# EasyEDA schematic SCH_DIY PowerBank_2023-05-28.json
TITLE: Sheet_1; REV: 1.0; Date: 2023-05-28; Sheet: 1/1; Drawn By: azlan777; Company: Your Company
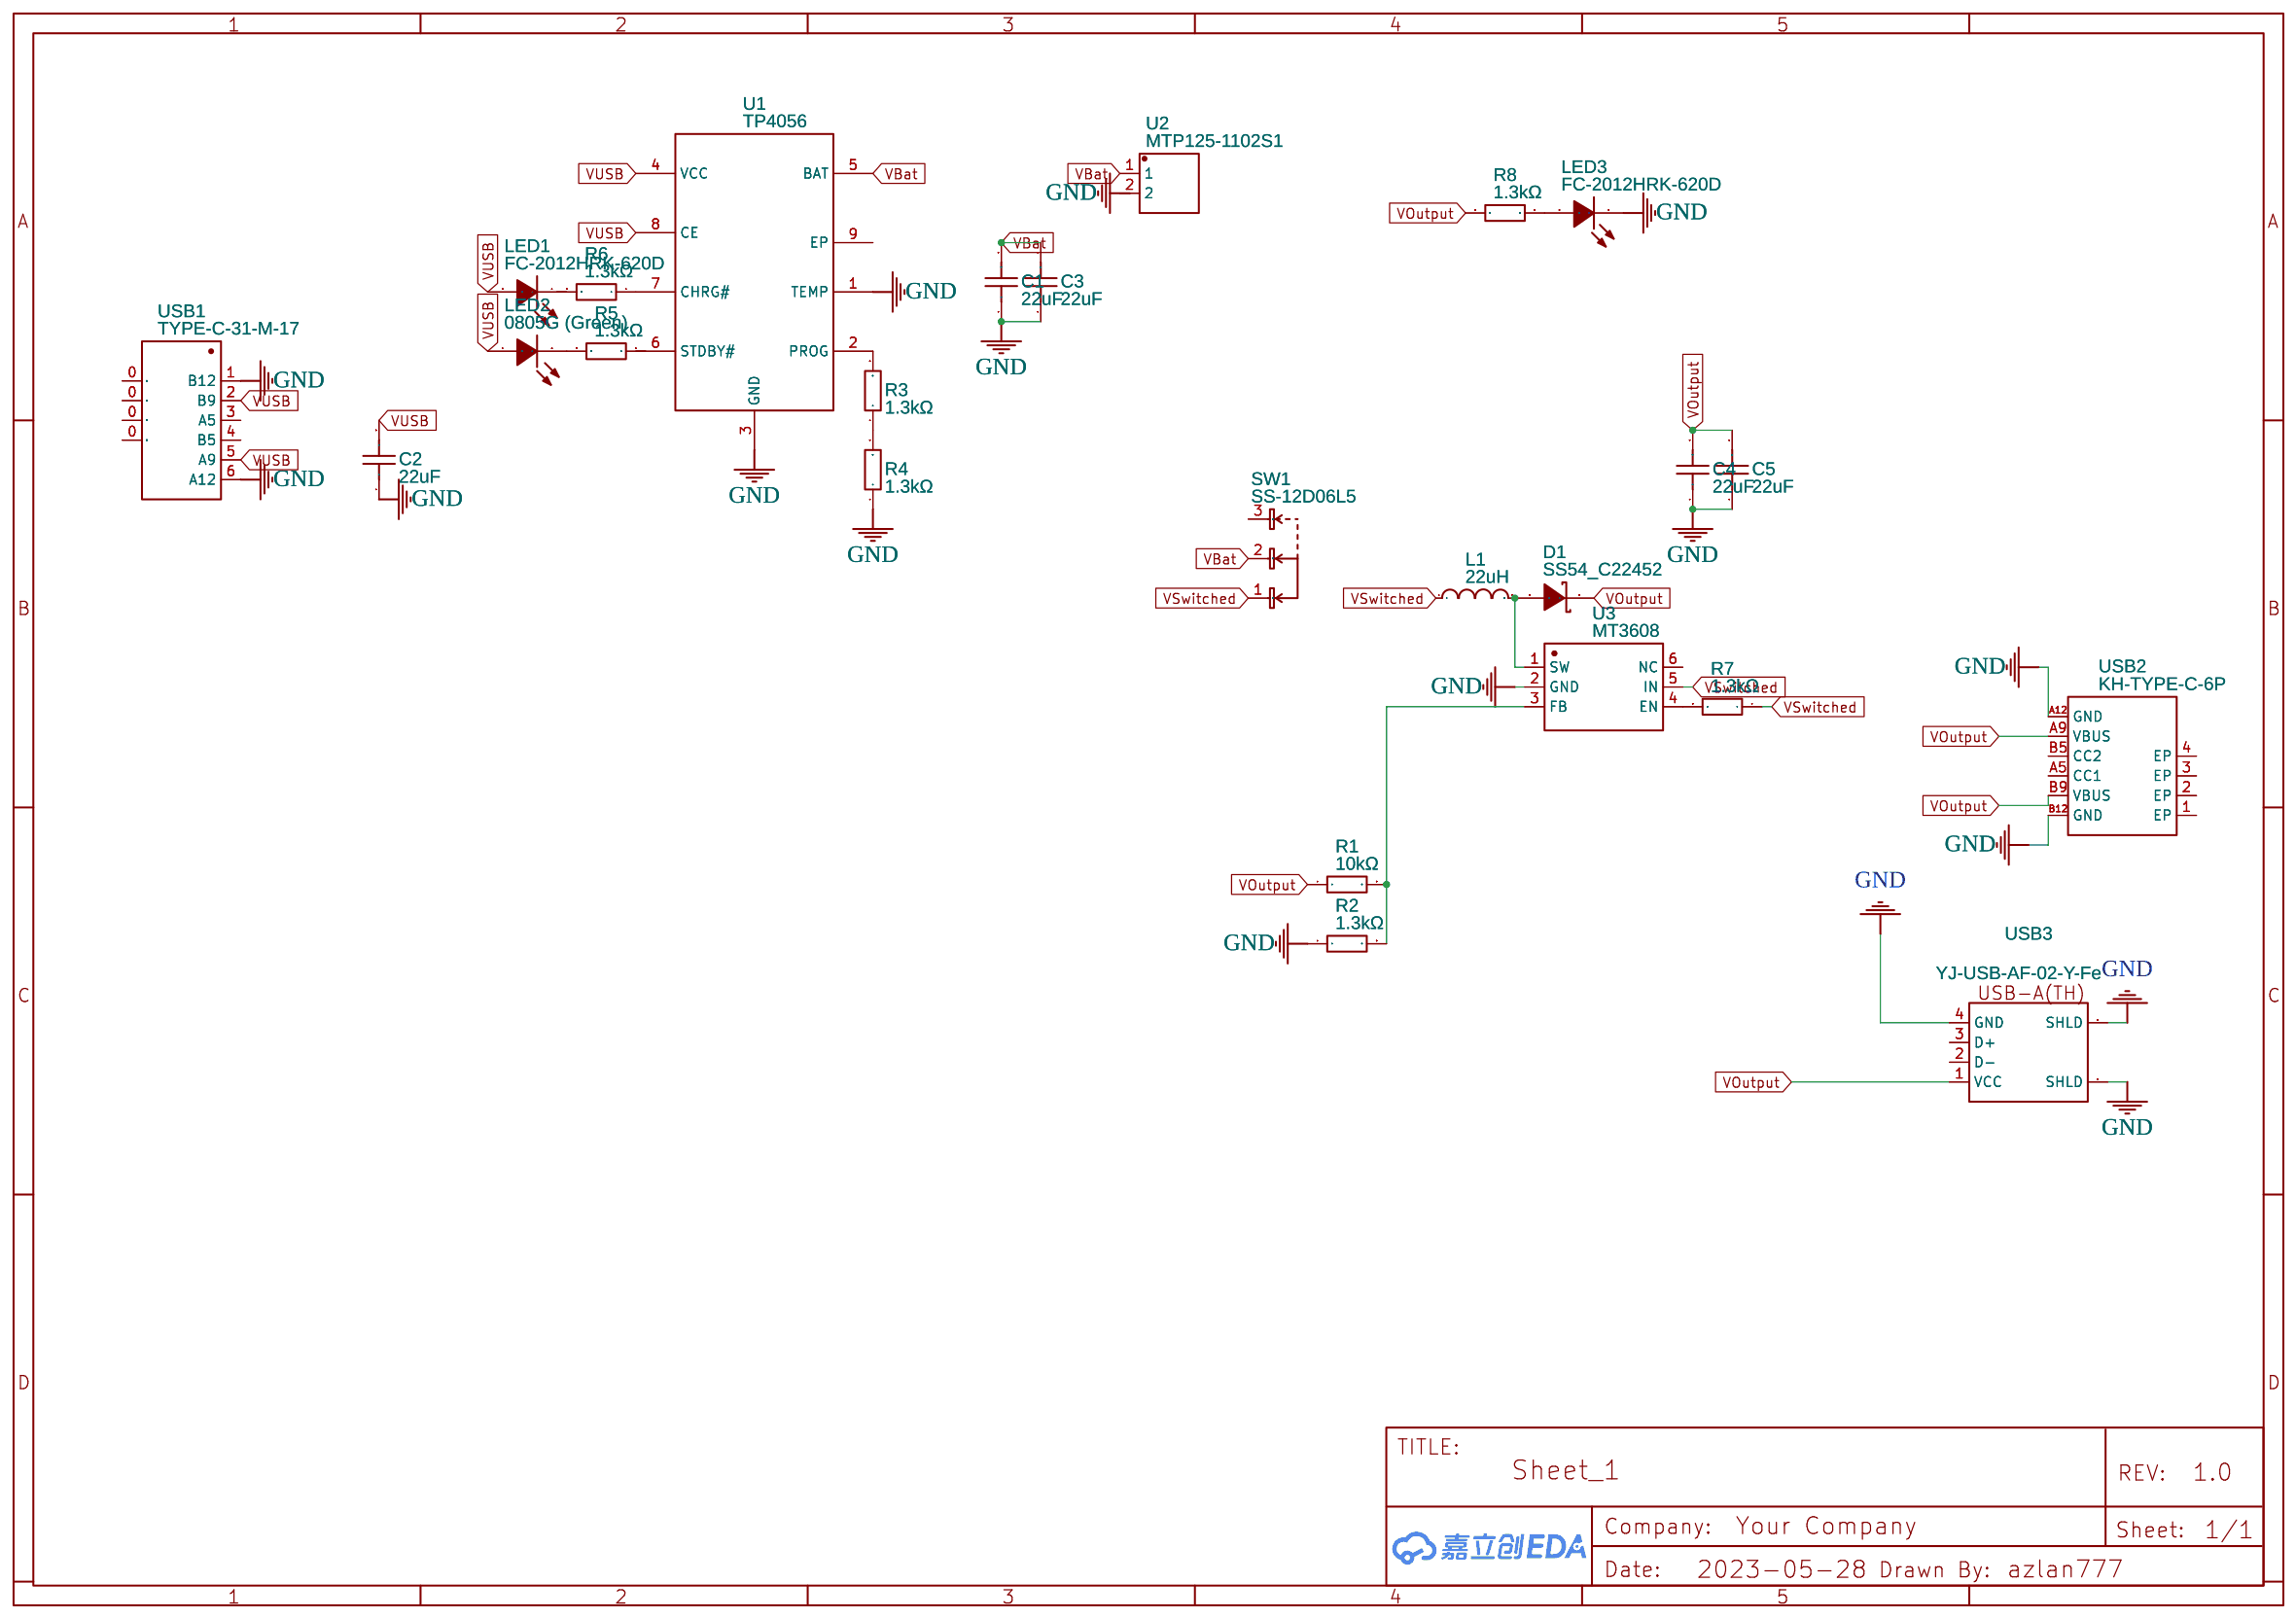
[diagram p0: schematic sheet]

## Parts
C1  22uF  [C0805]
C2  22uF  [C0805]
C3  22uF  [C0805]
C4  22uF  [C0805]
C5  22uF  [C0805]
D1  SS54_C22452  [SMA_L4.4-W2.8-LS5.4-R-RD]
L1  22uH  [IND-SMD_L7.8-W7.0_MAPM0630F]
LED1  FC-2012HRK-620D  [LED0805-RD_RED]
LED2  0805G (Green)  [LED0805-R-RD]
LED3  FC-2012HRK-620D  [LED0805-RD_RED]
R1  10kΩ  [R0603]
R2  1.3kΩ  [RES-TH_BD2.2-L6.5-P10.50-D0.6]
R3  1.3kΩ  [RES-TH_BD2.2-L6.5-P10.50-D0.6]
R4  1.3kΩ  [RES-TH_BD2.2-L6.5-P10.50-D0.6]
R5  1.3kΩ  [RES-TH_BD2.2-L6.5-P10.50-D0.6]
R6  1.3kΩ  [RES-TH_BD2.2-L6.5-P10.50-D0.6]
R7  1.3kΩ  [RES-TH_BD2.2-L6.5-P10.50-D0.6]
R8  1.3kΩ  [RES-TH_BD2.2-L6.5-P10.50-D0.6]
SW1  SS-12D06L5  [SW-TH_3P-P4.70_L11.1-W12.7]
U1  TP4056  [ESOP-8_L4.9-W3.9-P1.27-LS6.0-BL-EP]
U2  MTP125-1102S1  [HDR-TH_2P-P2.54-V-M-1]
U3  MT3608  [SOT-23-6_L2.9-W1.6-P0.95-LS2.8-BL]
USB1  TYPE-C-31-M-17  [USB-C-SMD_10P-P1.00-L6.8-W8.9]
USB2  KH-TYPE-C-6P  [TYPE-C-SMD_TYPE-C-31-M-16]
USB3  YJ-USB-AF-02-Y-Fe  [USB-A-TH_USB-A-F-90]

## Library data of the parts
C1-C5 = CL21A226MAQNNNE: Supplier: LCSC; Manufacturer: SAMSUNG(三星); Supplier Part: C45783; JLCPCB Part Class: Basic Part
D1 = SS54_C22452: Supplier: LCSC; Manufacturer Part: SS54; Manufacturer: MDD; Supplier Part: C22452; JLCPCB Part Class: Basic Part
L1 = JSHC0650H-220M-G: Supplier: LCSC; Supplier Part: C334097; Manufacturer: JINLAI(金籁科技); Contributor: LCSC; JLCPCB Part Class: Extended Part
LED1 LED3 = FC-2012HRK-620D: Supplier: LCSC; Manufacturer: 国星光电; Manufacturer Part: NCD0805R1; Supplier Part: C84256; JLCPCB Part Class: Basic Part
LED2 = 0805G (Green): Supplier: LCSC; Manufacturer: KENTO; Manufacturer Part: KT-0805翠绿; Supplier Part: C2297; JLCPCB Part Class: Basic Part
R1 = 0603WAF1002T5E: Supplier: LCSC; Manufacturer: UNI-ROYAL(厚声); Supplier Part: C25804; Resistance (Ohms): 10K; JLCPCB Part Class: Basic Part
R2-R8 = CF1/4W-1.3KΩ±5% T52: Supplier: LCSC; Supplier Part: C120058; Manufacturer: CCO(千志电子); Manufacturer Part: CF1/4W-1.3KΩ±5% T; Resistance (Ohms): 1.3K; Contributor: LCSC; JLCPCB Part Class: Extended Part
SW1 = SS-12D06L5: Supplier: LCSC; Supplier Part: C319015; Manufacturer: XKB Connectivity(中国星坤); Contributor: LCSC; JLCPCB Part Class: Extended Part
U1 = TP4056: Contributor: Guest; Supplier: LCSC; Manufacturer: TOPPOWER(南京拓微); Manufacturer Part: TP4056-42-ESOP8; Supplier Part: C16581; JLCPCB Part Class: Basic Part
U2 = MTP125-1102S1: Supplier: LCSC; Supplier Part: C358684; Manufacturer: MINTRON(明硕); Contributor: LCSC; JLCPCB Part Class: Extended Part
U3 = MT3608: Supplier: LCSC; Manufacturer: 西安航天民芯; Supplier Part: C84817; JLCPCB Part Class: Extended Part
USB1 = TYPE-C-31-M-17: Supplier: LCSC; Supplier Part: C283540; Manufacturer: 韩国韩荣; Contributor: LCSC; JLCPCB Part Class: Extended Part
USB2 = KH-TYPE-C-6P: Supplier: LCSC; Supplier Part: C709355; Manufacturer: kinghelm(金航标); Contributor: LCSC; JLCPCB Part Class: Extended Part
USB3 = YJ-USB-AF-02-Y-Fe: Supplier: LCSC; image: //image.lceda.cn/szlcsc/C2345.jpg; Contributor: LCSC; Supplier Part: C2345; LCSC Assembly: Yes; SMT Type: Extend; Assembly Type: manualWeld; Paste Type: expand; JLCPCB Part Class: Extended Part

## Nets
GND: C1.1 C2.1 C3.1 C4.1 C5.1 LED3.1(-) R2.1 R4.1 U1.1(TEMP) U1.3(GND) U2.2 U3.2(GND) USB1.1(B12) USB1.6(A12) USB2.A12(GND) USB2.B12(GND) USB3.0(SHLD) USB3.4(GND)
VBat: C1.2 C3.2 SW1.2 U1.5(BAT) U2.1
VOutput: C4.2 C5.2 D1.2(K) R1.1 R8.2 USB2.A9(VBUS) USB2.B9(VBUS) USB3.1(VCC)
VSwitched: L1.1 R7.1 SW1.1 U3.5(IN)
VUSB: C2.2 LED1.2(+) LED2.1(A) U1.4(VCC) U1.8(CE) USB1.2(B9) USB1.5(A9)
Net-(D1-1): D1.1(A) L1.2 U3.1(SW)
Net-(LED1-1): LED1.1(-) R6.2
Net-(LED2-2): LED2.2(K) R5.2
Net-(LED3-2): LED3.2(+) R8.1
Net-(R1-2): R1.2 R2.2 U3.3(FB)
Net-(R3-1): R3.1 R4.2
Net-(R3-2): R3.2 U1.2(PROG)
Net-(R5-1): R5.1 U1.6(STDBY#)
Net-(R6-1): R6.1 U1.7(CHRG#)
Net-(R7-2): R7.2 U3.4(EN)

Not connected (* = marked no-connect by the designer): SW1 3; U1 9(EP); U3 6(NC); USB1 0 3(A5) 4(B5); USB2 1(EP) 2(EP) 3(EP) 4(EP) A5(CC1) B5(CC2); USB3 2(D-) 3(D+)
